# EAGLE schematic Atrix_breakout (EAGLE 7.2.0)
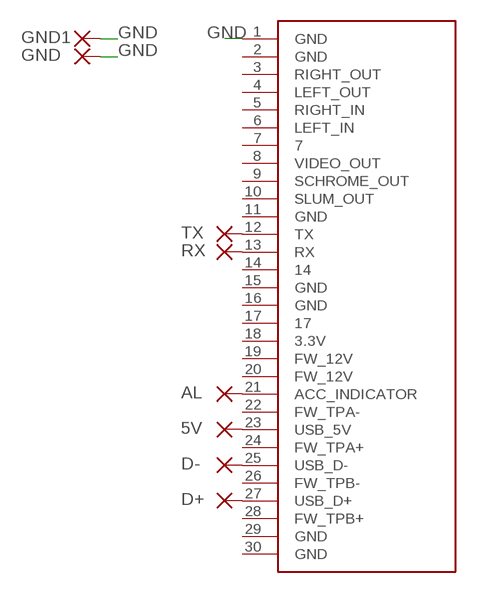
[diagram p0: schematic, sheet 1]

## Parts
5V  1,6/0,8  [1,6/0,8]
AL  1,6/0,8  [1,6/0,8]
D+  1,6/0,8  [1,6/0,8]
D-  1,6/0,8  [1,6/0,8]
GND  1,6/0,8  [1,6/0,8]
GND1  1,6/0,8  [1,6/0,8]
RX  1,6/0,8  [1,6/0,8]
TX  1,6/0,8  [1,6/0,8]
U$1  IPOD_CONNECTOR_MALE  [IPOD_MALE_CONNECTOR]

## Nets
GND: GND1.1(P) GND.1(P) U$1.1(GND)
N$2: AL.1(P) U$1.21(ACC_INDICATOR)
N$3: D-.1(P) U$1.25(USB_D-)
N$4: D+.1(P) U$1.27(USB_D+)
N$6: RX.1(P) U$1.13(RX)
N$7: TX.1(P) U$1.12(TX)
N$8: 5V.1(P) U$1.23(USB_5V)
Unconnected: U$1.2(GND) U$1.3(RIGHT_OUT) U$1.4(LEFT_OUT) U$1.5(RIGHT_IN) U$1.6(LEFT_IN) U$1.7 U$1.8(VIDEO_OUT) U$1.9(SCHROME_OUT) U$1.10(SLUM_OUT) U$1.11(GND) U$1.14 U$1.15(GND) U$1.16(GND) U$1.17 U$1.18(3.3V) U$1.19(FW_12V) U$1.20(FW_12V) U$1.22(FW_TPA-) U$1.24(FW_TPA+) U$1.26(FW_TPB-) U$1.28(FW_TPB+) U$1.29(GND) U$1.30(GND)

## Library data of the parts
5V AL D+ D- GND GND1 RX TX = wirepad:1,6/0,8: THROUGH-HOLE PAD
U$1 = SparkFun-Connectors:IPOD_CONNECTOR_MALE: iPod Male Connector This is the connector that will insert into an iPods. Use this connector to gain access to the various iPod pins. Schematic and footprint are not yet production proven. The PCB thickness must be more thin than the standard 0.062" FR4. Spark Fun Electronics SKU : DEV-00633